# Altium project sot23_connect.PrjPcb
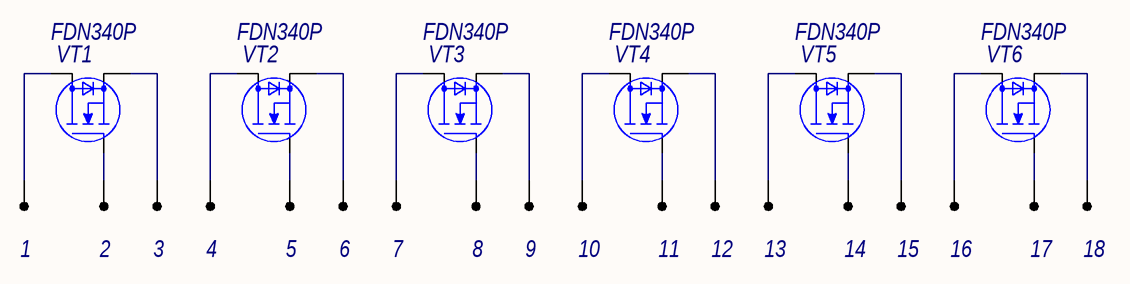
[diagram p0: Sheet1.SchDoc]
1 sheet, 24 parts. Net scope: global (net labels, ports and power ports of the same name join across sheets).
Board files: k.PcbDoc, PCB1.PcbDoc

## Sheet Sheet1.SchDoc: =title_line_1 + title_line_2
size 420 x 297 mm; SheetNumber: 1; SheetTotal: 1

### Parts
1  (no value)  [WIRE_SOLDER_POINT2.1_0.5]
2  (no value)  [WIRE_SOLDER_POINT2.1_0.5]
3  (no value)  [WIRE_SOLDER_POINT2.1_0.5]
4  (no value)  [WIRE_SOLDER_POINT2.1_0.5]
5  (no value)  [WIRE_SOLDER_POINT2.1_0.5]
6  (no value)  [WIRE_SOLDER_POINT2.1_0.5]
7  (no value)  [WIRE_SOLDER_POINT2.1_0.5]
8  (no value)  [WIRE_SOLDER_POINT2.1_0.5]
9  (no value)  [WIRE_SOLDER_POINT2.1_0.5]
10  (no value)  [WIRE_SOLDER_POINT2.1_0.5]
11  (no value)  [WIRE_SOLDER_POINT2.1_0.5]
12  (no value)  [WIRE_SOLDER_POINT2.1_0.5]
13  (no value)  [WIRE_SOLDER_POINT2.1_0.5]
14  (no value)  [WIRE_SOLDER_POINT2.1_0.5]
15  (no value)  [WIRE_SOLDER_POINT2.1_0.5]
16  (no value)  [WIRE_SOLDER_POINT2.1_0.5]
17  (no value)  [WIRE_SOLDER_POINT2.1_0.5]
18  (no value)  [WIRE_SOLDER_POINT2.1_0.5]
VT1  FDN340P  [SOT23]
VT2  FDN340P  [SOT23]
VT3  FDN340P  [SOT23]
VT4  FDN340P  [SOT23]
VT5  FDN340P  [SOT23]
VT6  FDN340P  [SOT23]

### Nets
Net1_1: 1.1 VT1.3(D)
Net2_1: 2.1 VT1.1(G)
Net3_1: 3.1 VT1.2(S)
Net4_1: 4.1 VT2.3(D)
Net5_1: 5.1 VT2.1(G)
Net6_1: 6.1 VT2.2(S)
Net7_1: 7.1 VT3.3(D)
Net8_1: 8.1 VT3.1(G)
Net9_1: 9.1 VT3.2(S)
Net10_1: 10.1 VT4.3(D)
Net11_1: 11.1 VT4.1(G)
Net12_1: 12.1 VT4.2(S)
Net13_1: 13.1 VT5.3(D)
Net14_1: 14.1 VT5.1(G)
Net15_1: 15.1 VT5.2(S)
Net16_1: 16.1 VT6.3(D)
Net17_1: 17.1 VT6.1(G)
Net18_1: 18.1 VT6.2(S)

### Notes on the sheet
- Перв. примен.
- Справ. №
- Подп. и дата
- Инв. № дубл.
- Нормоконтроль:
- Взам. инв. №
- Изм.
- Лист
- № докум.
- Подп.
- Дата
- Лит.
- Масса
- Масштаб
- Т.контр.
- Пров.
- Разраб.
- Листов
- Разработал:
- Инв. № подл.
- Н.контр.
- Утв.
- Копировал
- Формат
- А3

### Library data of the parts
1-18 = SolderPoint: Контакт
VT1-VT6 = FDN340P: Name: FDN340P